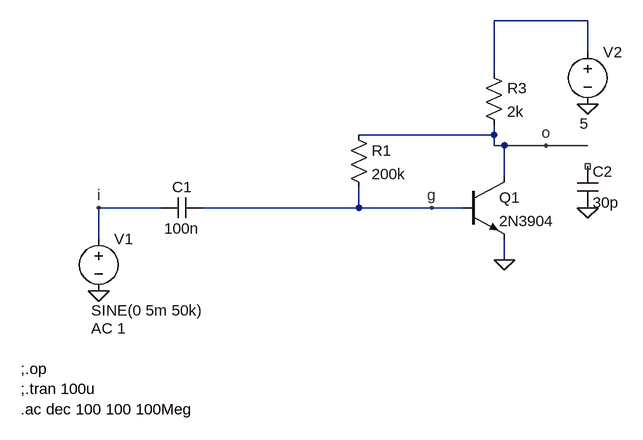
[diagram p0: schematic fig2.asc]
fig2.asc, the LTspice schematic file:
Version 4
SHEET 1 1620 680
WIRE 64 -240 -80 -240
WIRE 64 -192 64 -240
WIRE -80 -160 -80 -240
WIRE -80 -64 -80 -80
WIRE -80 -64 -288 -64
WIRE -80 -48 -80 -64
WIRE -64 -48 -80 -48
WIRE 0 -48 -64 -48
WIRE 64 -48 0 -48
WIRE -64 0 -64 -48
WIRE -592 48 -688 48
WIRE -288 48 -288 16
WIRE -288 48 -528 48
WIRE -176 48 -288 48
WIRE -128 48 -176 48
WIRE -688 96 -688 48
WIRE -64 128 -64 96
FLAG 64 -112 0
FLAG -688 176 0
FLAG -64 128 0
FLAG -688 48 i
FLAG -176 48 g
FLAG 0 -48 o
FLAG 64 48 0
SYMBOL voltage 64 -208 R0
WINDOW 123 0 0 Left 0
WINDOW 39 0 0 Left 0
WINDOW 3 -12 126 Left 2
SYMATTR Value 5
SYMATTR InstName V2
SYMBOL voltage -688 80 R0
WINDOW 123 -12 154 Left 2
WINDOW 39 0 0 Left 0
WINDOW 3 -12 126 Left 2
SYMATTR Value2 AC 1
SYMATTR Value SINE(0 5m 50k)
SYMATTR InstName V1
SYMBOL cap -528 32 R90
WINDOW 0 0 32 VBottom 2
WINDOW 3 32 32 VTop 2
SYMATTR InstName C1
SYMATTR Value 100n
SYMBOL res -304 -80 R0
SYMATTR InstName R1
SYMATTR Value 200k
SYMBOL cap 48 -16 R0
SYMATTR InstName C2
SYMATTR Value 30p
SYMBOL res -96 -176 R0
SYMATTR InstName R3
SYMATTR Value 2k
SYMBOL npn -128 0 R0
SYMATTR InstName Q1
SYMATTR Value 2N3904
TEXT -808 296 Left 2 !;.op\n;.tran 100u\n.ac dec 100 100 100Meg

The netlist it stands for:
* fig2.asc
V2 N001 0 5
V1 i 0 SINE(0 5m 50k) AC 1
C1 g i 100n
R1 o g 200k
C2 NC_01 0 30p
R3 N001 o 2k
Q1 o g 0 0 2N3904
.model NPN NPN
.model PNP PNP
.lib standard.bjt
;.op
;.tran 100u
.ac dec 100 100 100Meg
.backanno
.end